# Altium project ad_via.PrjPcb
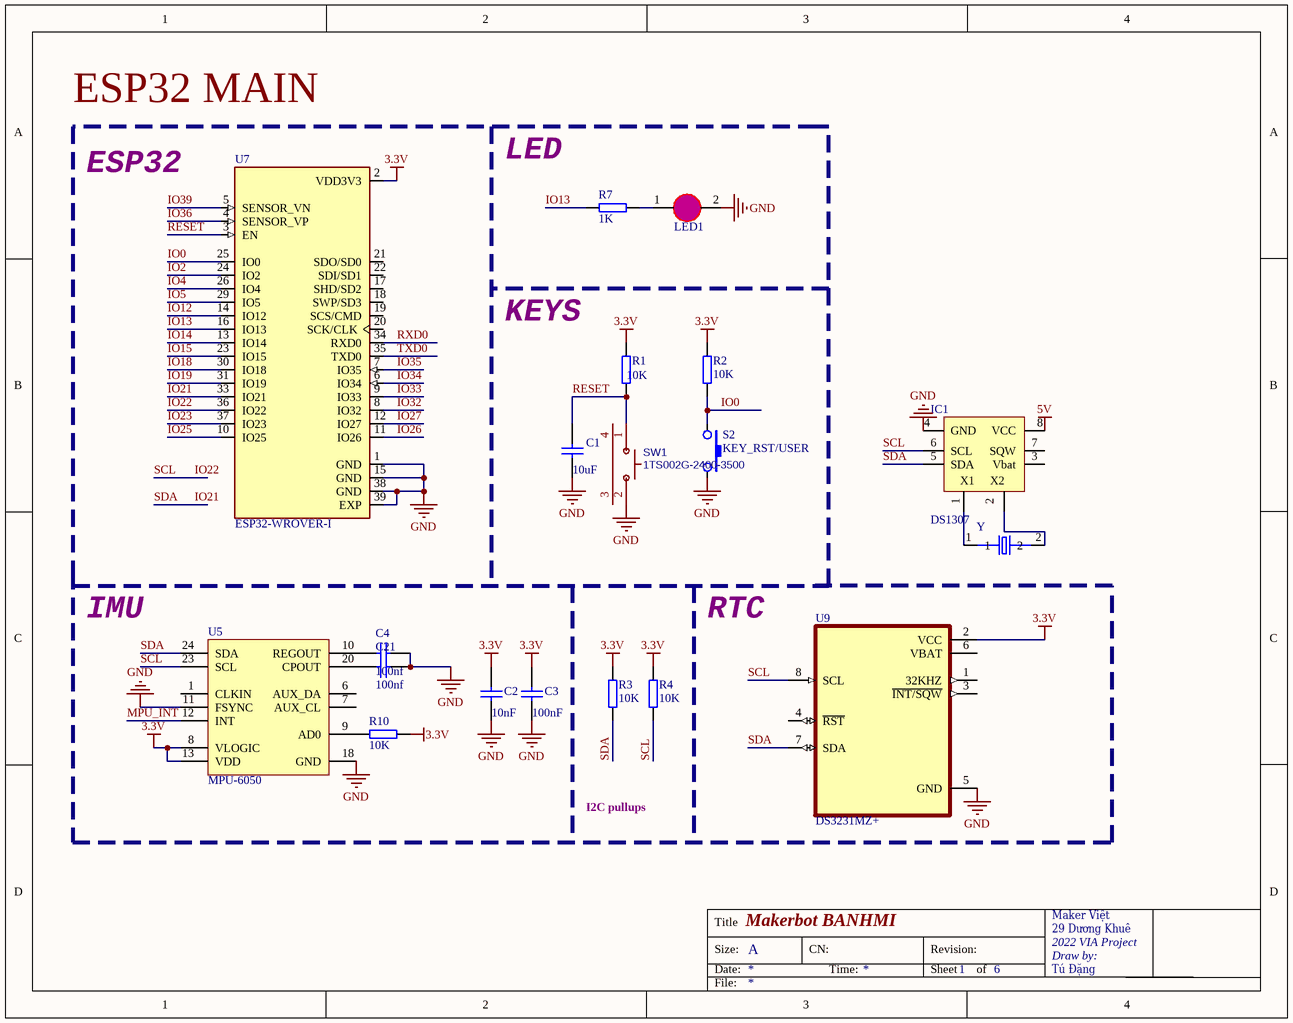
[diagram p0: main_esp.SchDoc]
Rev: B.MSP.2; Title: Makerbot BANMI
6 sheets, 74 parts. Net scope: global (net labels, ports and power ports of the same name join across sheets).
Board file: VIA6.2.PcbDoc
Sheets:
  main_esp.SchDoc
  POWER.SchDoc
  Usb_To_UART.SchDoc
  CONNECTROS.SchDoc
  RS485_CAN.SchDoc
  Mic_SPK2.SchDoc

## Sheet main_esp.SchDoc: Makerbot BANHMI
size A; Organization: Altium Limited; Address1: L3, 12a Rodborough Rd; Address2: Frenchs Forest; Address3: NSW; Address4: Australia 2086; SheetNumber: 1; SheetTotal: 6

### Parts
C1  value 10uF  [SMT0603]  (hidden comment: Cap Semi)
C2  value 10nF  [SMT0603]  (hidden comment: Cap Semi)
C3  value 100nF  [SMT0603]  (hidden comment: Cap Semi)
C4  value 100nf  [SMT0603]  (hidden comment: Cap Semi)
C21  value 100nf  [SMT0603]  (hidden comment: Cap Semi)
IC1  DS1307  [SOIC-8]
LED1  LED3  [LED0805]  (value not drawn)
R1  value 10K  [SMT0603]  (hidden comment: Resistor)
R2  value 10K  [SMT0603]  (hidden comment: Resistor)
R3  value 10K  [SMT0603]  (hidden comment: Resistor)
R4  value 10K  [SMT0603]  (hidden comment: Resistor)
R7  value 1K  [SMT0603]  (hidden comment: Resistor)
R10  value 10K  [SMT0603]  (hidden comment: Resistor)
S2  KEY_RST/USER  [SMT_SW_PTS_820]
SW1  1TS002G-2400-3500  [KEY-SMD_1TS002G]
U5  MPU-6050  [MPU-6050]
U7  ESP32-WROVER-I  [XCVR_ESP32-WROVER-I]
U9  DS3231MZ+  [SOIC127P600X175-8N]
Y  ABS07AIG-32.768KHZ-7-1-T  [XTAL320X150X90]  (value not drawn)

### Blocks framed on the sheet
ESP32 MAIN: C1 LED1 R1 R2 R7 S2 SW1 U7

### Nets
3.3V: C2.2 C3.2 R1.2 R2.2 R3.2 R4.2 R10.1 U5.8(VLOGIC) U5.13(VDD) U7.2(VDD3V3) U9.2(VCC)
5V: IC1.8(VCC)
GND: C1.1 C2.1 C3.1 C4.1 C21.1 IC1.4(GND) LED1.2(K) S2.2 SW1.2 U5.11(FSYNC) U5.18(GND) U7.1(GND) U7.15(GND) U7.38(GND) U7.39(EXP) U9.5(GND)
VCC: IC1.8(VCC)
IO0: R2.1 S2.1 U7.25(IO0)
IO2: U7.24(IO2)
IO4: U7.26(IO4)  [project net I2S_DIN]
IO5: U7.29(IO5)
IO12: U7.14(IO12)
IO13: R7.1 U7.16(IO13)
IO14: U7.13(IO14)
IO15: U7.23(IO15)
IO18: U7.30(IO18)
IO19: U7.31(IO19)
IO21: IC1.5(SDA) R3.1 U5.24(SDA) U7.33(IO21) U9.7(SDA)  [also labelled SDA]
IO22: IC1.6(SCL) R4.1 U5.23(SCL) U7.36(IO22) U9.8(SCL)  [also labelled SCL]
IO23: U7.37(IO23)  [project net CAN_RX]
IO25: U7.10(IO25)  [project net CAN_TX]
IO26: U7.11(IO26)  [project net BCLK]
IO27: U7.12(IO27)
IO32: U7.8(IO32)
IO33: U7.9(IO33)  [project net I2S_DOUT]
IO34: U7.6(IO34)
IO35: U7.7(IO35)
IO36: U7.4(SENSOR_VP)
IO39: U7.5(SENSOR_VN)
MPU_INT: U5.12(INT)
RESET: C1.2 R1.1 SW1.1 U7.3(EN)
RXD0: U7.34(RXD0)
TXD0: U7.35(TXD0)
NetC4_2: C4.2 U5.10(REGOUT)
NetC21_2: C21.2 U5.20(CPOUT)
NetIC1_1: IC1.1(X1) Y.1
NetIC1_2: IC1.2(X2) Y.2
NetLED1_1: LED1.1(A) R7.2
NetR10_2: R10.2 U5.9(AD0)

Not connected (* = marked no-connect by the designer): IC1 3(Vbat) 7(SQW); SW1 3 4; U5 1(CLKIN) 6(AUX_DA) 7(AUX_CL); U7 17(SHD/SD2) 18(SWP/SD3) 19(SCS/CMD) 20(SCK/CLK) 21(SDO/SD0) 22(SDI/SD1); U9 1(32KHZ) 3(~{INT/SQW}) 4(~{RST}) 6(VBAT)

### Notes on the sheet
- LED
- ESP32
- KEYS
- IMU
- RTC
- I2C pullups
- Title
- Size:
- Date:
- A
- CN:
- Time:
- Revision:
- Sheet
- of
- Maker Việt
- 29 Dương Khuê
- 2022 VIA Project
- Draw by:
- Tú Đặng
- File:

### Library data of the parts
C1 C2 C4 C21 = CAP-SM-0603-X5R-10uF: CAP SM 0603 X5R 10uF 10%; Tolerance: ±10%; Supplier 1: Farnell; Supplier 2: Digi-Key; Supplier Part Number 1: 2366833; Supplier Part Number 2: 490-3896-1-ND
C3 = CAP-SM-0603-X7R-100nF: CAP SM 0603 X7R 100nF 10%; Tolerance: ±10%; Supplier 1: Digi-Key; Supplier 2: Farnell; Supplier Part Number 1: 490-3167-1-ND; Supplier Part Number 2: 1775994RL
IC1 = DS1307: Real Timer Serial; Value: DS1307
LED1 = LED0805: LED SMD 0805
R1-R4 R10 = RES-SM-0603-10K: RES SM 0603 10K; Supplier 1: Farnell; Supplier 2: Digi-Key; Supplier Part Number 1: 9330399; Supplier Part Number 2: 541-10.0KHCT-ND
R7 = RES-SM-0603-1K: RES SM 0603 1K
S2 = SMT_SW_PTS_820: SMT Tactile ‎Switch PTS 820 Series
SW1 = 1TS002G-2400-3500: BOM_Manufacturer: HYP; Contributor: LCSC; BOM_Supplier: LCSC; BOM_Supplier Part: C319378; BOM_Manufacturer Part: 1TS002G-2400-3500; spicePre: S; spiceSymbolName: 1TS002G-2400-3500
U7 = ESP32-WROVER-I: Bluetooth, WiFi 802.11b/g/n, Bluetooth v4.2 + EDR, Class 1, 2 and 3 Transceiver Module 2.4GHz ~ 2.5GHz Antenna Not Included, I-PEX Surface Mount; MF: Espressif Systems; Package: Module Espressif Systems; Availability: Unavailable; MP: ESP32-WROVER-I; Value: *; SnapEDA_Link: https://www.snapeda.com/parts/ESP32-WROVER-I/Espressif%20Systems/view-part/2298808/?ref=snap; Price: None
U9 = DS3231MZ+: Real Time Clock _RTC_ IC Clock/Calendar IÂ²C, 2-Wire Serial 8-SOIC _0.154, 3.90mm Width_; MF: Maxim Integrated; MP: DS3231MZ; Price: None; Availability: Unavailable; Package: SOIC-8 Maxim Integrated; SnapEDA_Link: https://www.snapeda.com/parts/DS3231MZ/Maxim%20Integrated/view-part/2834343/?ref=snap; Value: *
Y = ABS07AIG-32.768KHZ-7-1-T: 32.768kHz Â±10ppm Crystal 7pF 80 kOhms 2-SMD, No Lead; MF: Abracon; SnapEDA_Link: https://www.snapeda.com/parts/ABS07AIG-32.768KHZ-7-1-T/Abracon%20LLC/view-part/1099811/?ref=snap; Package: SMD-2 Abracon; MP: ABS07AIG-32.768KHZ-7-1-T; Digi-Key_Part_Number: 535-13354-1-ND; Value: *; BuyPart: https://www.snapeda.com/parts/ABS07AIG-32.768KHZ-7-1-T/Abracon%20LLC/view-part/1099811/?ref=eda

## Sheet POWER.SchDoc: Makerbot BANMI
size A; Organization: Altium Limited; Address1: 29 Dương Khuê; Address2: 2022 VIA Project; Address3: Draw by:; Address4: Tú Đặng; Revision: B.MSP.2
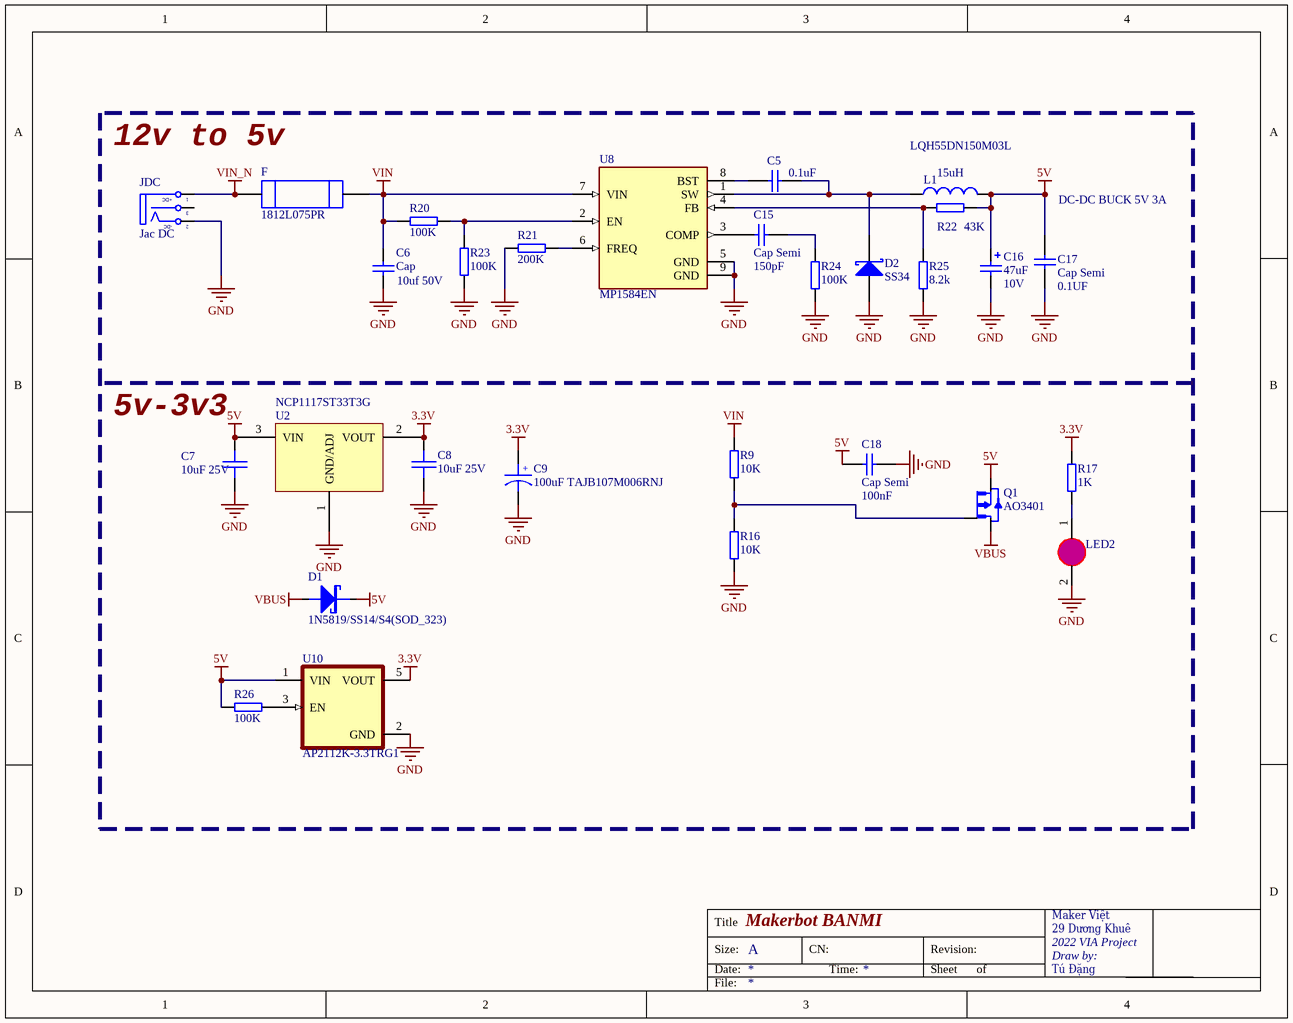
[diagram p1: POWER.SchDoc]

### Parts
C5  value 0.1uF  [SMT0603]  (hidden comment: Cap Semi)
C6  Cap  value 10uf 50V  [1206]
C7  10uF 25V  [SMT_C_0805]
C8  10uF 25V  [SMT_C_0805]
C9  100uF TAJB107M006RNJ  [SMT_C_Tantalum_B]
C15  Cap Semi  value 150pF  [SMT0603]
C16  47uF  Voltage: 10V  [Tantal_B]
C17  Cap Semi  value 0.1UF  [SMT0603]
C18  Cap Semi  value 100nF  [SMT0603]
D1  1N5819/SS14/S4(SOD_323)  [SMT_DIODE_SOD_323]
D2  SS34  [SMB]
F  1812L075PR  [1812]
JDC  Jac DC  [DC-IN]
L1  15uH  Marka: LQH55DN150M03L  [Inductor SMD 6.8*6.8*4.5]
LED2  LED3  [LED0805]  (value not drawn)
Q1  AO3401  [SOT23]
R9  value 10K  [SMT0603]  (hidden comment: Resistor)
R16  value 10K  [SMT0603]  (hidden comment: Resistor)
R17  value 1K  [SMT0603]  (hidden comment: Resistor)
R20  value 100K  [SMT0603]  (hidden comment: Resistor)
R21  value 200K  [SMT0603]  (hidden comment: Resistor)
R22  value 43K  [SMT0603]  (hidden comment: Resistor)
R23  value 100K  [SMT0603]  (hidden comment: Resistor)
R24  value 100K  [SMT0603]  (hidden comment: Resistor)
R25  value 8.2k  [SMT0603]  (hidden comment: Resistor)
R26  value 100K  [SMT0603]  (hidden comment: Resistor)
U2  NCP1117ST33T3G  [SOT-223]
U8  MP1584EN  [SOIC127P600X170-9N]
U10  AP2112K-3.3TRG1  [SOT95P285X140-5N]

### Nets
3.3V: C8.1 C9.1 R17.1 U2.2(VOUT) U10.5(VOUT)
5V: C7.1 C16.1 C17.1 C18.1 D1.2(K) L1.2 Q1.2(S) R22.1 R26.2 U2.3(VIN) U10.1(VIN)
GND: C6.2 C7.2 C8.2 C9.2 C16.2 C17.2 C18.2 D2.1(A) JDC.2(TN) LED2.2(K) R16.1 R21.1 R23.2 R24.1 R25.2 U2.1(GND/ADJ) U8.5(GND) U8.9(GND) U10.2(GND)
VBUS: D1.1(A) Q1.3(D)
VIN: C6.1 F.2 R9.2 R20.1 U8.7(VIN)
VIN_N: F.1 JDC.1(T)
NetC5_1: C5.1 D2.2(K) L1.1 U8.1(SW)
NetC5_2: C5.2 U8.8(BST)
NetC15_1: C15.1 R24.2
NetC15_2: C15.2 U8.3(COMP)
NetLED2_1: LED2.1(A) R17.2
NetQ1_1: Q1.1(G) R9.1 R16.2
NetR20_2: R20.2 R23.1 U8.2(EN)
NetR21_2: R21.2 U8.6(FREQ)
NetR22_2: R22.2 R25.1 U8.4(FB)
NetR26_1: R26.1 U10.3(EN)

Not connected (* = marked no-connect by the designer): JDC 3(S)

### Notes on the sheet
- 12v to 5v
- (near C17) DC-DC BUCK 5V 3A
- (near C7) 5v-3v3
- Title
- Size:
- Date:
- A
- CN:
- Time:
- Revision:
- Sheet
- of
- Maker Việt
- 29 Dương Khuê
- 2022 VIA Project
- Draw by:
- Tú Đặng
- File:
- (in symbol DCIN) +DC; -DC
- (in symbol SMT_C_Tantalum_B) +

### Library data of the parts
C5 C15 C17 = CAP-SM-0603-X5R-10uF: CAP SM 0603 X5R 10uF 10%; Tolerance: ±10%; Supplier 1: Farnell; Supplier 2: Digi-Key; Supplier Part Number 1: 2366833; Supplier Part Number 2: 490-3896-1-ND
C6 = Cap: Capacitor; Published: 8-Jun-2000; LatestRevisionDate: 17-Jul-2002; LatestRevisionNote: Re-released for DXP Platform.; PackageReference: RAD-0.3; Publisher: Altium Limited; PackageDescription: Radial Cap, Thru-Hole; 2 Leads; 0.3 in Pin Spacing
C7 C8 = SMT_C_0805: Surface mount capacitor 0805
C9 = SMT_C_Tantalum_B: Capacitor, SM Tantalum; Body 3.5 x 2.8 mm (LxW typ)
C16 = Cap Pol: Polarized Capacitor (Axial); Published: 8-Jun-2000; LatestRevisionDate: 17-Jul-2002; LatestRevisionNote: Re-released for DXP Platform.; PackageReference: POLAR0.8; Publisher: Altium Limited; PackageDescription: Polarized Capacitor; 2 Leads; links: https://www.promelec.ru/product/327656/; price: 12.53
C18 = CAP-SM-0603-X7R-100nF: CAP SM 0603 X7R 100nF 10%; Tolerance: ±10%; Supplier 1: Digi-Key; Supplier 2: Farnell; Supplier Part Number 1: 490-3167-1-ND; Supplier Part Number 2: 1775994RL
D1 = SMT_DIODE_SCHOTTKY_SOD_323: Surface mount schottky diode SOD-323(0805) Package
D2 = D Schottky: Schottky Diode; Published: 8-Jun-2000; LatestRevisionDate: 17-Jul-2002; LatestRevisionNote: Re-released for DXP Platform.; PackageReference: SMB; Publisher: Altium Limited; PackageDescription: DO-214-AA/SMB; 2 C-Bend Leads; Body 5.3 x 3.6 mm, inc. leads (LxW); Code_JEDEC: DO-214-AA
F = 1812L075PR: Polymeric PTC Resettable Fuse 13.2V 750mA Ih Surface Mount 1812 _4532 Metric_, Concave; MF: Littelfuse Inc.; SnapEDA_Link: https://www.snapeda.com/parts/1812L075PR/Littelfuse%20Inc./view-part/46903/?ref=snap; MP: 1812L075PR; Availability: Unavailable; Price: None; Value: *; Package: 1812 Littelfuse
JDC = DCIN: Jac DC input; Value: Jac DC
L1 = Inductor: price: 68.07; links: https://www.promelec.ru/product/318749/
LED2 = LED0805: LED SMD 0805
Q1 = AO3401: P-Channel 30V 4A _Ta_ 1.4W _Ta_ Surface Mount SOT-23-3; MF: Alpha & Omega Semiconductor; Value: *; MP: AO3401; SnapEDA_Link: https://www.snapeda.com/parts/AO3401/Alpha%20%26%20Omega%20Semiconductor/view-part/4592622/?ref=snap; Availability: Unavailable; Package: SOT-23-3 Alpha &amp; Omega Semiconductor; Price: None
R9 R16 = RES-SM-0603-10K: RES SM 0603 10K; Supplier 1: Farnell; Supplier 2: Digi-Key; Supplier Part Number 1: 9330399; Supplier Part Number 2: 541-10.0KHCT-ND
R17 R20-R26 = RES-SM-0603-100K: RES SM 0603 100K; Supplier 1: Farnell; Supplier 2: Digi-Key; Supplier Part Number 1: 1344361; Supplier Part Number 2: 541-100KHCT-ND
U2 = NCP1117: NCP1117, NCV1117. 1.0 A Low-Dropout Positive  Fixed and Adjustable  Voltage Regulators
U8 = MP1584EN: Buck Switching Regulator IC Positive Adjustable 0.8V 1 Output 3A 8-SOIC _0.154, 3.90mm Width_ Exposed Pad; MF: Monolithic Power; MP: MP1584EN; Value: *; Package: SOIC-8 Monolithic Power; SnapEDA_Link: https://www.snapeda.com/parts/MP1584EN/Monolithic%20Power%20Systems%20Inc./view-part/891721/?ref=snap; Price: None; Availability: Unavailable
U10 = AP2112K-3.3TRG1: Linear Voltage Regulator IC 1 Output 600mA SOT-25; MF: Diodes Inc.; Digi-Key_Part_Number: AP2112K-3.3TRG1DICT-ND; SnapEDA_Link: https://www.snapeda.com/parts/AP2112K-3.3TRG1/Diodes%20Inc./view-part/454988/?ref=snap; Package: SOT-753 Diodes Inc.; MP: AP2112K-3.3TRG1; Value: *; Digi-Key_Purchase_URL: https://www.digikey.com.au/product-detail/en/diodes-incorporated/AP2112K-3.3TRG1/AP2112K-3.3TRG1DICT-ND/4505257?utm_source=snapeda&utm_medium=aggregator&utm_campaign=symbol

## Sheet Usb_To_UART.SchDoc: Makerbot BANMI
size A; Organization: Altium Limited; Address1: 29 Dương Khuê; Address2: 2022 VIA Project; Address3: Draw by:; Address4: Tú Đặng; Revision: B.MSP.2
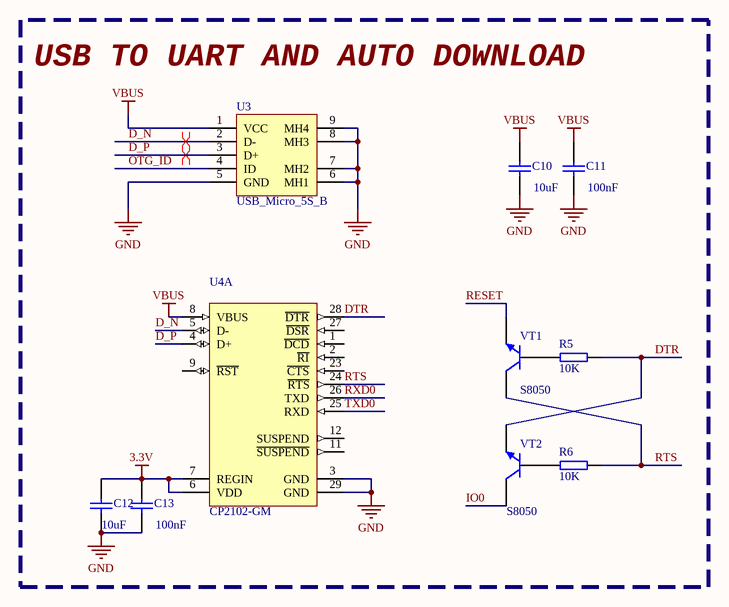
[diagram p2: Usb_To_UART.SchDoc]

### Parts
C10  value 10uF  [SMT0603]  (hidden comment: Cap Semi)
C11  value 100nF  [SMT0603]  (hidden comment: Cap Semi)
C12  value 10uF  [SMT0603]  (hidden comment: Cap Semi)
C13  value 100nF  [SMT0603]  (hidden comment: Cap Semi)
R5  value 10K  [SMT0603]  (hidden comment: Resistor)
R6  value 10K  [SMT0603]  (hidden comment: Resistor)
U3  USB_Micro_5S_B  [USB_MICRO_5S_B]
U4  CP2102-GM  [CP2102]  (part A of 2)
VT1  S8050  [SMT_TRIODE_NPN]
VT2  S8050  [SMT_TRIODE_NPN]

### Blocks framed on the sheet
USB TO UART AND AUTO DOWNLOAD: C10-C13 R5 R6 U3 U4 VT1 VT2

### Nets
3.3V: C12.2 C13.2 U4.6(VDD) U4.7(REGIN)
GND: C10.1 C11.1 C12.1 C13.1 U3.5(GND) U3.6(MH1) U3.7(MH2) U3.8(MH3) U3.9(MH4) U4.3(GND) U4.29(GND)
VBUS: C10.2 C11.2 U3.1(VCC) U4.8(VBUS)
D_N: U3.2(D-) U4.5(D-)
D_P: U3.3(D+) U4.4(D+)
DTR: R5.1 U4.28(~{DTR}) VT2.2(E)
IO0: VT2.3(C)
OTG_ID: U3.4(ID)
RESET: VT1.2(E)
RTS: R6.1 U4.24(~{RTS}) VT1.3(C)
RXD0: U4.26(TXD)
TXD0: U4.25(RXD)
NetR5_2: R5.2 VT1.1(B)
NetR6_2: R6.2 VT2.1(B)

Not connected (* = marked no-connect by the designer): U4 1(~{DCD}) 2(~{RI}) 9(~{RST}) 11(~{SUSPEND}) 12(SUSPEND) 23(~{CTS}) 27(~{DSR})

### Layout directives
differential pair: D_N, D_P

### Notes on the sheet
- Title
- Size:
- Date:
- A
- CN:
- Time:
- Revision:
- Sheet
- of
- Maker Việt
- 29 Dương Khuê
- 2022 VIA Project
- Draw by:
- Tú Đặng
- File:

### Library data of the parts
C10 C12 = CAP-SM-0603-X5R-10uF: CAP SM 0603 X5R 10uF 10%; Tolerance: ±10%; Supplier 1: Farnell; Supplier 2: Digi-Key; Supplier Part Number 1: 2366833; Supplier Part Number 2: 490-3896-1-ND
C11 C13 = CAP-SM-0603-X7R-100nF: CAP SM 0603 X7R 100nF 10%; Tolerance: ±10%; Supplier 1: Digi-Key; Supplier 2: Farnell; Supplier Part Number 1: 490-3167-1-ND; Supplier Part Number 2: 1775994RL
R5 R6 = RES-SM-0603-10K: RES SM 0603 10K; Supplier 1: Farnell; Supplier 2: Digi-Key; Supplier Part Number 1: 9330399; Supplier Part Number 2: 541-10.0KHCT-ND
U3 = USB_Micro_5S_B: USB micro female SMT with 4 fixed foot
U4 = CP2102-GM: Single-Chip USB to UART Bridge, 1024 Bytes EEPROM, -40 to 85 degC, 28-pin QFN, Tube; Manufacturer: Silicon Labs; Internal Oscillator: TRUE; Sub-Family: USB Bridges; DatasheetVersion: Rev. 1.5; PackageReference: QFN-28; PackageDescription: 28-Pin Quad-Flat No-Leads Package, Body 5 x 5 mm, Pitch 0.5 mm; Supplier 1: Digi-Key; Supplier Part Number 1: 336-1160-5-ND; Supplier 2: Farnell; Supplier Part Number 2: 9282130; Supplier 3: Newark; Supplier Part Number 3: 30K5635; Supplier 4: Mouser; Supplier Part Number 4: 634-CP2102-GM; EEPROM: 1024 Bytes; Mounting Technology: Surface Mount; Code_JEDEC: MO-220; Code_IPC: J-STD-020C; PartNumber: CP2102-GM; ComponentLink1Description: Manufacturer URL; ComponentLink1URL: http://www.silabs.com/; ComponentLink2Description: Datasheet; ComponentLink2URL: http://www.silabs.com/Support%20Documents/TechnicalDocs/CP2102-9.pdf; ComponentLink3Description: Package Specification; ComponentLink3URL: http://www.silabs.com/Support%20Documents/TechnicalDocs/C8051T61x.pdf
VT1 VT2 = SMT_TRIODE_NPN: Surface mount NPN transistor, package SOT-23

## Sheet CONNECTROS.SchDoc: Makerbot BANMI
size A; Organization: Altium Limited; Address1: 29 Dương Khuê; Address2: 2022 VIA Project; Address3: Draw by:; Address4: Tú Đặng; Revision: B.MSP.2
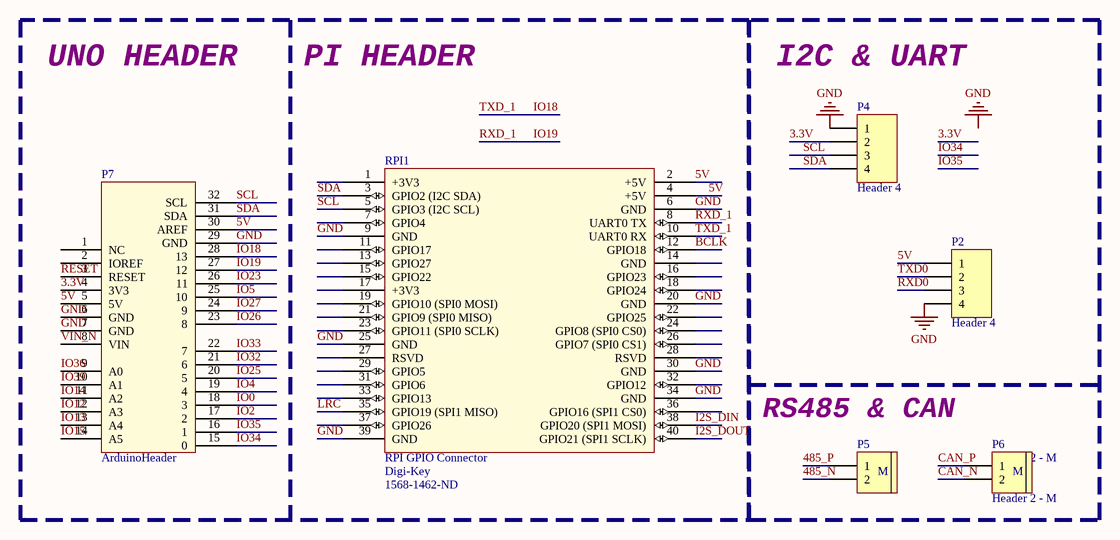
[diagram p3: CONNECTROS.SchDoc]

### Parts
P2  Header 4  [HDR1X4]
P4  Header 4  [CONN-TH_XH2.54-4AW]
P5  Header 2 - M  [Medium - Header 2]
P6  Header 2 - M  [Medium - Header 2]
P7  ArduinoHeader  [ArduinoClone2]
RPI1  RPI GPIO Connector  Supplier 1: Digi-Key  Supplier Part Number 1: 1568-1462-ND  [rpi]

### Blocks framed on the sheet
I2C & UART: P2 P4-P6

### Nets
3.3V: P4.2 P7.4(3V3)
5V: P2.1 P7.5(5V) P7.30(AREF) RPI1.2(+5V) RPI1.4(+5V)
GND: P2.4 P4.1 P7.6(GND) P7.7(GND) P7.29(GND) RPI1.6(GND) RPI1.9(GND) RPI1.20(GND) RPI1.25(GND) RPI1.30(GND) RPI1.34(GND) RPI1.39(GND)
VIN_N: P7.8(VIN)
485_N: P5.2
485_P: P5.1
BCLK: P7.23(8) RPI1.12(GPIO18)  [also labelled IO26]
CAN_N: P6.2
CAN_P: P6.1
I2S_DIN: P7.19(4) RPI1.38(GPIO20_(SPI1_MOSI))  [also labelled IO4]
I2S_DOUT: P7.22(7) RPI1.40(GPIO21_(SPI1_SCLK))  [also labelled IO33]
IO0: P7.18(3)
IO2: P7.17(2)
IO5: P7.25(10)
IO12: P7.12(A3)
IO13: P7.13(A4)
IO14: P7.11(A2)
IO15: P7.14(A5)
IO18: P7.28(13) RPI1.10(UART0_RX)  [also labelled TXD_1]
IO19: P7.27(12) RPI1.8(UART0_TX)  [also labelled RXD_1]
IO23: P7.26(11)  [project net CAN_RX]
IO25: P7.20(5)  [project net CAN_TX]
IO27: P7.24(9) RPI1.35(GPIO19_(SPI1_MISO))  [also labelled LRC]
IO32: P7.21(6)
IO34: P7.15(0)
IO35: P7.16(1)
IO36: P7.9(A0)
IO39: P7.10(A1)
RESET: P7.3(RESET)
RXD0: P2.3
SCL: P4.3 P7.32(SCL) RPI1.5(GPIO3_(I2C_SCL))  [project net IO22]
SDA: P4.4 P7.31(SDA) RPI1.3(GPIO2_(I2C_SDA))  [project net IO21]
TXD0: P2.2

Not connected (* = marked no-connect by the designer): P7 1(NC) 2(IOREF); RPI1 1(+3V3) 7(GPIO4) 11(GPIO17) 13(GPIO27) 14(GND) 15(GPIO22) 16(GPIO23) 17(+3V3) 18(GPIO24) 19(GPIO10_(SPI0_MOSI)) 21(GPIO9_(SPI0_MISO)) 22(GPIO25) 23(GPIO11_(SPI0_SCLK)) 24(GPIO8_(SPI0_CS0)) 26(GPIO7_(SPI0_CS1)) 27(RSVD) 28(RSVD) 29(GPIO5) 31(GPIO6) 32(GPIO12) 33(GPIO13) 36(GPIO16_(SPI1_CS0)) 37(GPIO26)

### Notes on the sheet
- UNO HEADER
- PI HEADER
- (near P5) RS485 & CAN
- Labels drawn without touching a wire or pin: GND
- Title
- Size:
- Date:
- A
- CN:
- Time:
- Revision:
- Sheet
- of
- Maker Việt
- 29 Dương Khuê
- 2022 VIA Project
- Draw by:
- Tú Đặng
- File:
- (in symbol Header 2 - M) M

### Library data of the parts
P2 P4 = Header 4: Header, 4-Pin; LatestRevisionDate: 17-Jul-2002; LatestRevisionNote: Re-released for DXP Platform.; Publisher: Altium Limited
P5 P6 = Header 2 - M: Header, 2-Pin, Medium; LatestRevisionDate: 17-Jul-2002; LatestRevisionNote: Re-released for DXP Platform.; Publisher: Altium Limited
RPI1 = rpi connector: GPIO Header for Raspberry Pi A+/B+/Pi 2/Pi 3 - 2x20; Manufacturer: SparkFun Electronics; Manufacturer Part Number: PRT-14017; Nils Minor: author; nilsminor@web.de: mail; RoHS: RoHS Compliant; Category: Development Boards, Kits, Programmers; Stock 1: 150; Pricing 1: 1=1.84 (EUR); Part Status: Active; Accessory Type: Connector; For Use With/Related Products: Raspberry Pi; ComponentLink1URL: https://cdn.sparkfun.com/datasheets/Dev/RaspberryPi/12313.pdf; ComponentLink1Description: https://cdn.sparkfun.com/datasheets/Dev/RaspberryPi/12313.pdf

## Sheet RS485_CAN.SchDoc: Makerbot BANMI
size A; Organization: Altium Limited; Address1: 29 Dương Khuê; Address2: 2022 VIA Project; Address3: Draw by:; Address4: Tú Đặng; Revision: B.MSP.2
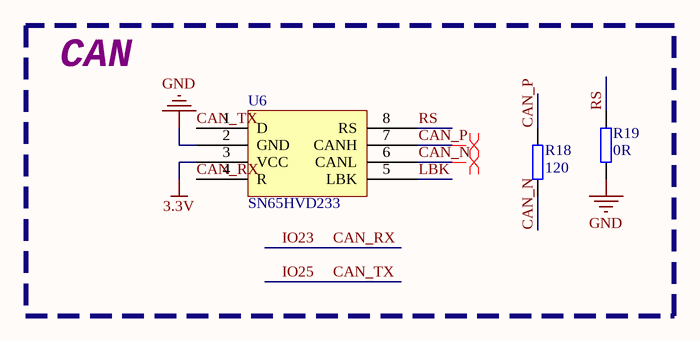
[diagram p4: RS485_CAN.SchDoc]

### Parts
R18  value 120  [SMT0603]  (hidden comment: Resistor)
R19  value 0R  [SMT0603]  (hidden comment: Resistor)
U6  SN65HVD233  [PCBComponent_1]

### Blocks framed on the sheet
CAN: R18 R19 U6

### Nets
3.3V: U6.3(VCC)
GND: R19.1 U6.2(GND)
CAN_N: R18.1 U6.6(CANL)
CAN_P: R18.2 U6.7(CANH)
CAN_RX: U6.4(R)  [also labelled IO23]
CAN_TX: U6.1(D)  [also labelled IO25]
LBK: U6.5(LBK)
RS: R19.2 U6.8(RS)

### Layout directives
differential pair: CAN_N, CAN_P

### Notes on the sheet
- Title
- Size:
- Date:
- A
- CN:
- Time:
- Revision:
- Sheet
- of
- Maker Việt
- 29 Dương Khuê
- 2022 VIA Project
- Draw by:
- Tú Đặng
- File:

### Library data of the parts
R18 R19 = RES-SM-0603-10K: RES SM 0603 10K; Supplier 1: Farnell; Supplier 2: Digi-Key; Supplier Part Number 1: 9330399; Supplier Part Number 2: 541-10.0KHCT-ND

## Sheet Mic_SPK2.SchDoc: Makerbot BANMI
size A; Organization: Altium Limited; Address1: 29 Dương Khuê; Address2: 2022 VIA Project; Address3: Draw by:; Address4: Tú Đặng; Revision: B.MSP.2
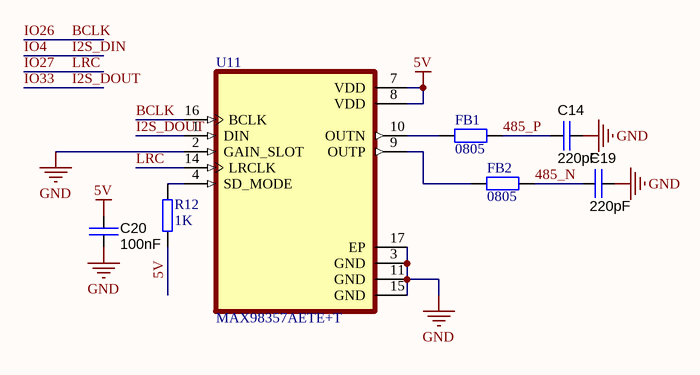
[diagram p5: Mic_SPK2.SchDoc]

### Parts
C14  220pF  [CAPC1608X90N]
C19  220pF  [CAPC1608X90N]
C20  100nF  [CAPC1608X90N]
FB1  value 0805  [DIEN TRO 0805]  (hidden comment: R0805)
FB2  value 0805  [DIEN TRO 0805]  (hidden comment: R0805)
R12  value 1K  [SMT0603]  (hidden comment: Resistor)
U11  MAX98357AETE+T  [QFN50P300X300X80-17N]

### Nets
5V: C20.1 R12.1 U11.7(VDD) U11.8(VDD)
GND: C14.2 C19.2 C20.2 U11.2(GAIN_SLOT) U11.3(GND) U11.11(GND) U11.15(GND) U11.17(EP)
485_N: C19.1 FB2.2
485_P: C14.1 FB1.2
BCLK: U11.16(BCLK)  [also labelled IO26]
I2S_DOUT: U11.1(DIN)  [also labelled IO33]
IO27: U11.14(LRCLK)  [also labelled LRC]
NetFB1_1: FB1.1 U11.10(OUTN)
NetFB2_1: FB2.1 U11.9(OUTP)
NetR12_2: R12.2 U11.4(SD_MODE)

### Notes on the sheet
- Title
- Size:
- Date:
- A
- CN:
- Time:
- Revision:
- Sheet
- of
- Maker Việt
- 29 Dương Khuê
- 2022 VIA Project
- Draw by:
- Tú Đặng
- File:

### Library data of the parts
C14 C19 C20 = CAP C_0603: Capacitor SMD Cer 470nF 10% 16V X7R 0603; Manufacturer 1: Murata Electronics North America; Manufacturer Part Number 1: GRM188R71C474KA88D; Ratings: 16V; X7R; Material: ceramic; SCDType: spec; Package / Case: 0603 (1608 metric); Tolerance: ±10%; Manufacturer 2: TDK Corporation; Manufacturer Part Number 2: C1608X7R1C474K; Supplier 1: Digi-Key; Supplier Part Number 1: 490-3295-2-ND; Supplier 2: Digi-Key; Supplier Part Number 2: 445-5192-2-ND; Supplier 3: Digi-Key; Supplier Part Number 3: 587-1250-2-ND; Manufacturer 3: Taiyo Yuden; Manufacturer Part Number 3: EMK107B7474KA-T; Manufacturer 4: Samsung; Manufacturer Part Number 4: CL10B474KONE; ComponentLink1URL: http://psearch.murata.com/capacitor/product/GRM188R71C474KA88#.pdf; ComponentLink1Description: http://psearch.murata.com/capacitor/product/GRM188R71C474KA88#.pdf; ComponentLink2URL: http://product.tdk.com/capacitor/mlcc/en/documents/mlcc_commercial_general_en.pdf; ComponentLink2Description: http://product.tdk.com/capacitor/mlcc/en/documents/mlcc_commercial_general_en.pdf; ComponentLink3URL: http://www.yuden.co.jp/or/product/category/capacitor/EMK107B7474KA-T.pdf; ComponentLink3Description: http://www.yuden.co.jp/or/product/category/capacitor/EMK107B7474KA-T.pdf
  C14 C19: Value: 220pF
  C20: Value: 100nF
FB1 FB2 = R0805: Resistor SMD 0805; Published: 8-Jun-2000; LatestRevisionDate: 17-Jul-2002; LatestRevisionNote: Re-released for DXP Platform.; PackageReference: AXIAL-0.4; Publisher: Altium Limited
R12 = RES-SM-0603-1K: RES SM 0603 1K
U11 = MAX98357AETE+T: Amplifier IC 1-Channel _Mono_ Class D 16-TQFN _3x3_; MF: Maxim Integrated; MP: MAX98357AETE+T; Availability: Unavailable; SnapEDA_Link: https://www.snapeda.com/parts/MAX98357AETE%2BT/Maxim%20Integrated/view-part/48842/?ref=snap; Package: TQFN-16 Maxim; Price: None; Value: *

## Nets that join several sheets
3.3V: main_esp (11 pins), POWER (5 pins), Usb_To_UART (C12.2 C13.2 U4.6 U4.7), CONNECTROS (P4.2 P7.4), RS485_CAN (U6.3)
5V: main_esp (IC1.8), POWER (11 pins), CONNECTROS (5 pins), Mic_SPK2 (C20.1 R12.1 U11.7 U11.8)
GND: main_esp (16 pins), POWER (19 pins), Usb_To_UART (11 pins), CONNECTROS (12 pins), RS485_CAN (R19.1 U6.2), Mic_SPK2 (8 pins)
VBUS: POWER (D1.1 Q1.3), Usb_To_UART (C10.2 C11.2 U3.1 U4.8)
VIN_N: POWER (F.1 JDC.1), CONNECTROS (P7.8)
485_N: CONNECTROS (P5.2), Mic_SPK2 (C19.1 FB2.2)
485_P: CONNECTROS (P5.1), Mic_SPK2 (C14.1 FB1.2)
BCLK: main_esp (U7.11), CONNECTROS (P7.23 RPI1.12), Mic_SPK2 (U11.16)
CAN_N: CONNECTROS (P6.2), RS485_CAN (R18.1 U6.6)
CAN_P: CONNECTROS (P6.1), RS485_CAN (R18.2 U6.7)
CAN_RX: main_esp (U7.37), CONNECTROS (P7.26), RS485_CAN (U6.4)
CAN_TX: main_esp (U7.10), CONNECTROS (P7.20), RS485_CAN (U6.1)
I2S_DIN: main_esp (U7.26), CONNECTROS (P7.19 RPI1.38)
I2S_DOUT: main_esp (U7.9), CONNECTROS (P7.22 RPI1.40), Mic_SPK2 (U11.1)
IO0: main_esp (R2.1 S2.1 U7.25), Usb_To_UART (VT2.3), CONNECTROS (P7.18)
IO2: main_esp (U7.24), CONNECTROS (P7.17)
IO5: main_esp (U7.29), CONNECTROS (P7.25)
IO12: main_esp (U7.14), CONNECTROS (P7.12)
IO13: main_esp (R7.1 U7.16), CONNECTROS (P7.13)
IO14: main_esp (U7.13), CONNECTROS (P7.11)
IO15: main_esp (U7.23), CONNECTROS (P7.14)
IO18: main_esp (U7.30), CONNECTROS (P7.28 RPI1.10)
IO19: main_esp (U7.31), CONNECTROS (P7.27 RPI1.8)
IO21: main_esp (5 pins), CONNECTROS (P4.4 P7.31 RPI1.3)
IO22: main_esp (5 pins), CONNECTROS (P4.3 P7.32 RPI1.5)
IO27: main_esp (U7.12), CONNECTROS (P7.24 RPI1.35), Mic_SPK2 (U11.14)
IO32: main_esp (U7.8), CONNECTROS (P7.21)
IO34: main_esp (U7.6), CONNECTROS (P7.15)
IO35: main_esp (U7.7), CONNECTROS (P7.16)
IO36: main_esp (U7.4), CONNECTROS (P7.9)
IO39: main_esp (U7.5), CONNECTROS (P7.10)
RESET: main_esp (C1.2 R1.1 SW1.1 U7.3), Usb_To_UART (VT1.2), CONNECTROS (P7.3)
RXD0: main_esp (U7.34), Usb_To_UART (U4.26), CONNECTROS (P2.3)
TXD0: main_esp (U7.35), Usb_To_UART (U4.25), CONNECTROS (P2.2)